# Altium schematic sheet Current Measurement.SchDoc
size C; DrawnBy: Ross Harvey; Engineer: Ross Harvey; Revision: A; SheetNumber: 2; SheetTotal: 7
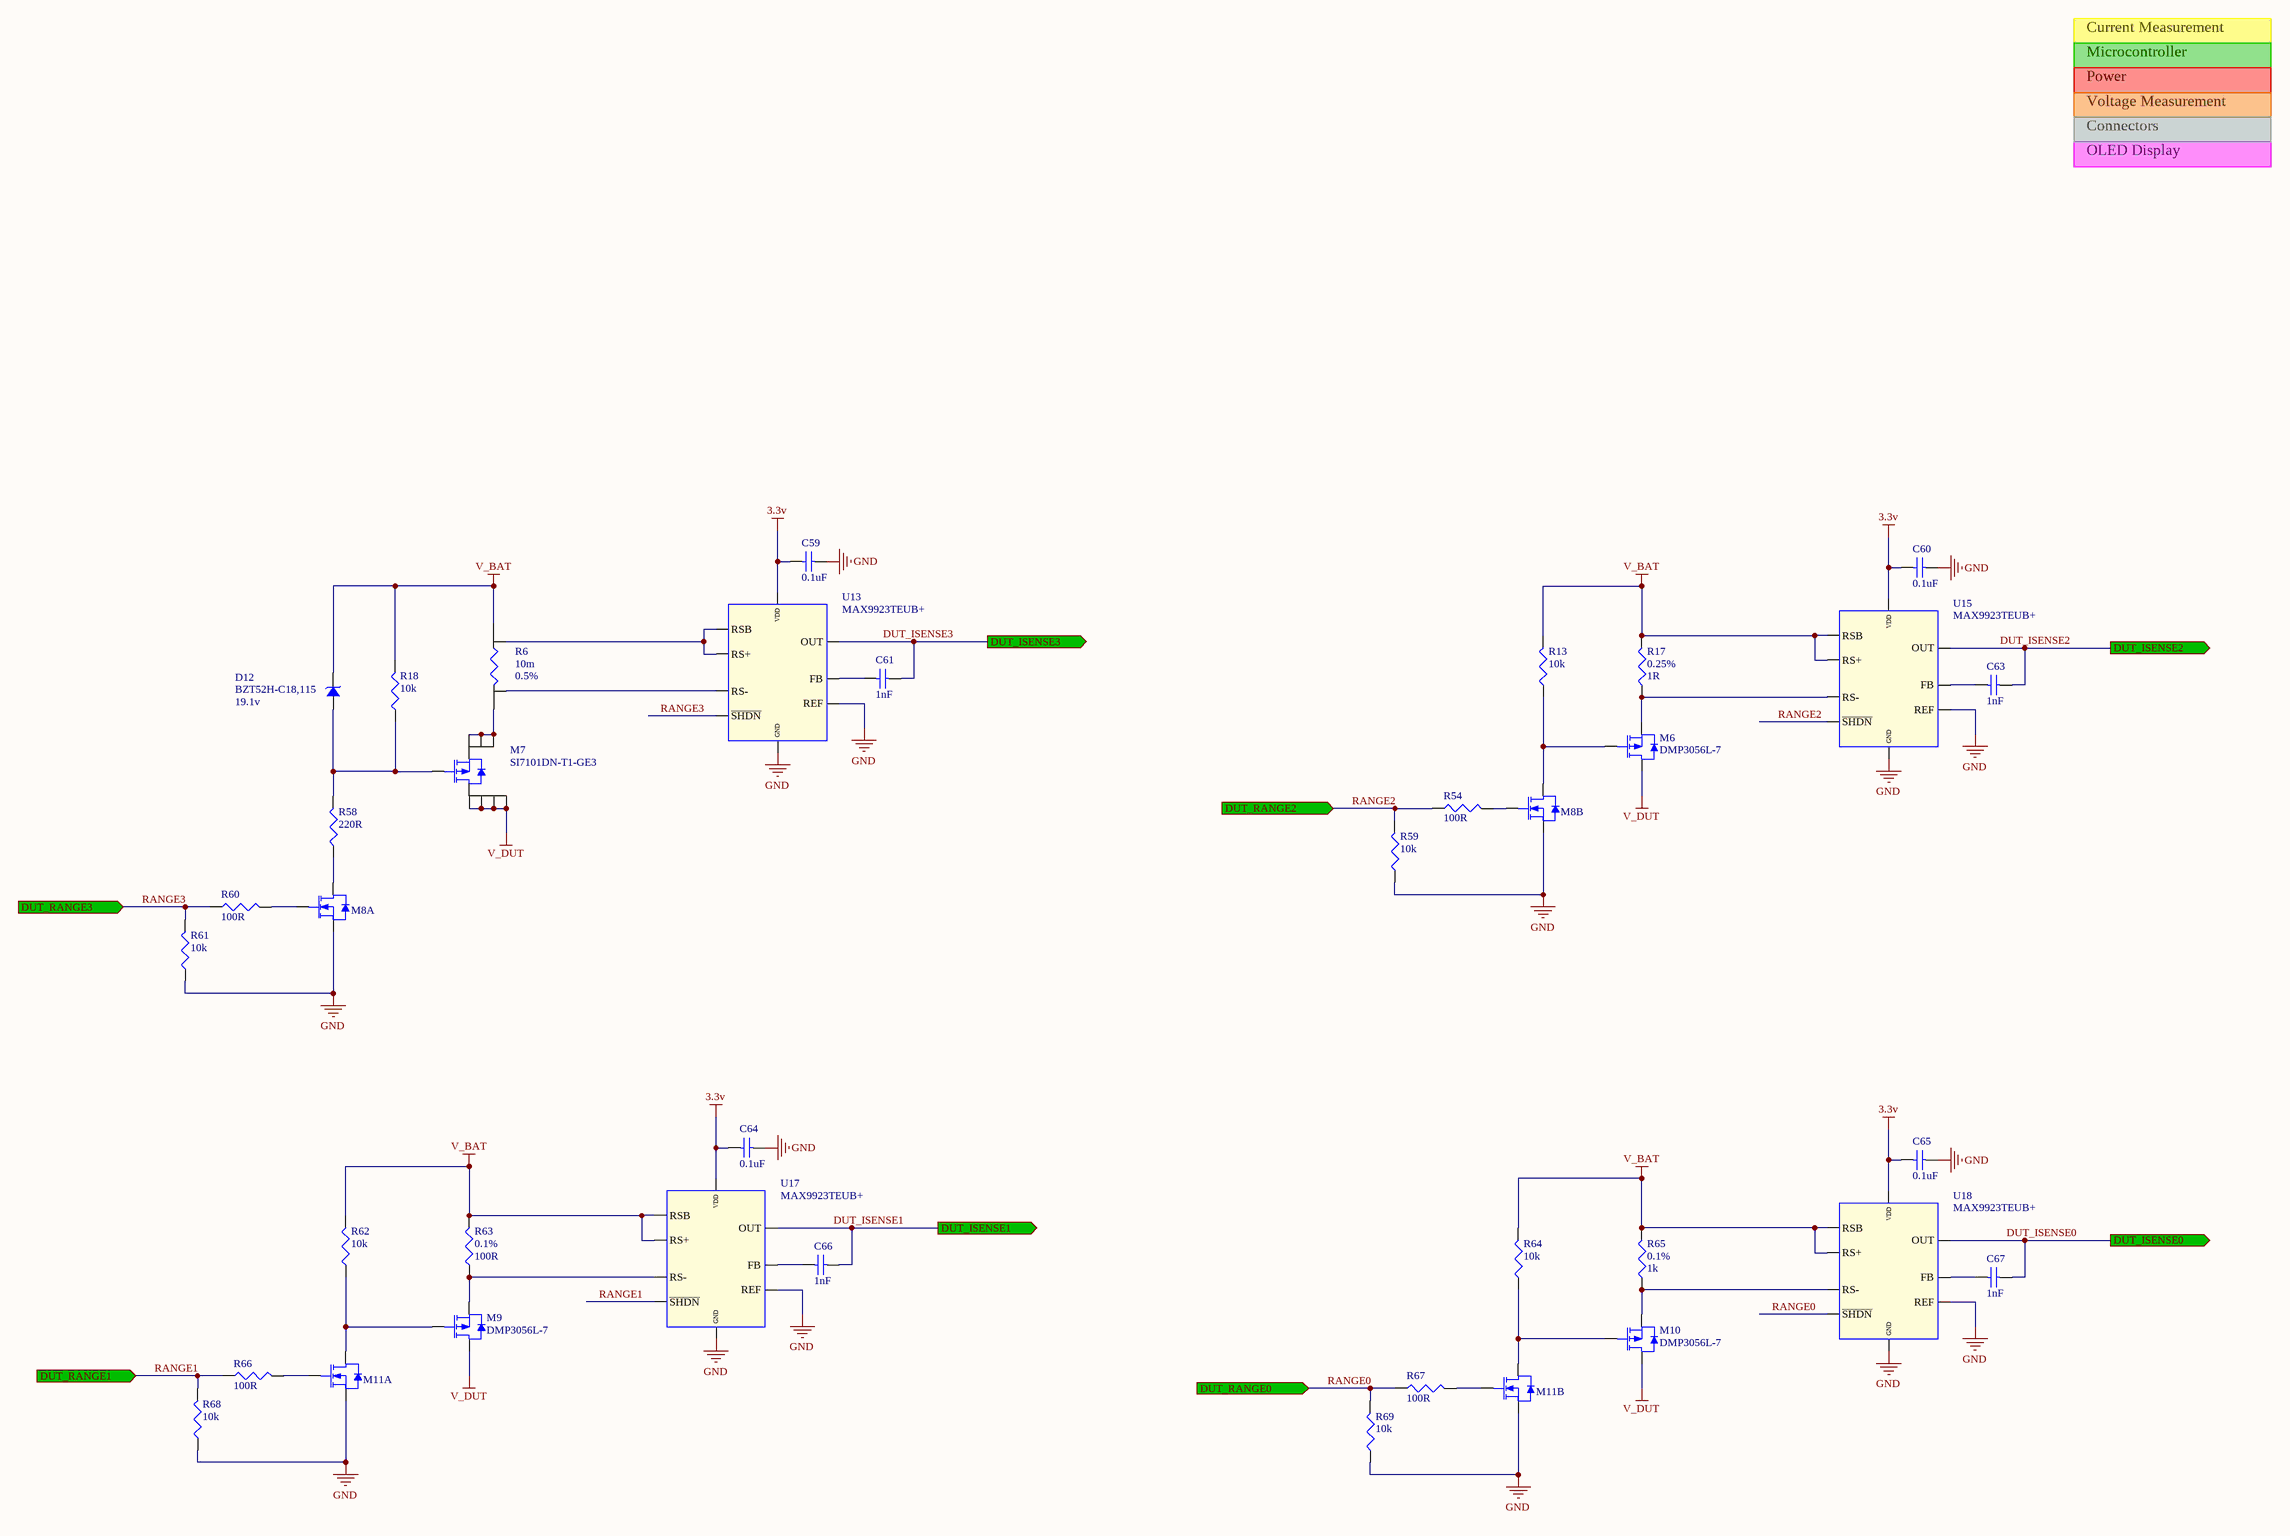
[diagram p0: Current Measurement.SchDoc]

## Parts
C59  0.1uF  [CAP0402R]
C60  0.1uF  [CAP0402R]
C61  1nF  [CAP0402R]
C63  1nF  [CAP0402R]
C64  0.1uF  [CAP0402R]
C65  0.1uF  [CAP0402R]
C66  1nF  [CAP0402R]
C67  1nF  [CAP0402R]
D12  BZT52H-C18,115  OPER_VOLTAGE: 19.1v  [SOD-123]
M6  DMP3056L-7  [SOT23-3M]
M7  SI7101DN-T1-GE3  [PowerPAK-1212-8]
M8  NX3020NAKV,115  [SOT666-6N]  (value not drawn)  (parts A,B of 2)
M9  DMP3056L-7  [SOT23-3M]
M10  DMP3056L-7  [SOT23-3M]
M11  NX3020NAKV,115  [SOT666-6N]  (value not drawn)  (parts A,B of 2)
R6  10m  TOLERANCE: 0.5%  [2512 4 Terminal]
R13  10k  [RES0603R]
R17  Tolerance: 0.25%  [RES0805R]  (hidden comment: 1R)
R18  10k  [RES0603R]
R54  100R  [RES0402R]
R58  220R  [RES0603R]
R59  10k  [RES0402R]
R60  100R  [RES0402R]
R61  10k  [RES0402R]
R62  10k  [RES0603R]
R63  Tolerance: 0.1%  [RES0603W]  (hidden comment: 100R)
R64  10k  [RES0603R]
R65  Tolerance: 0.1%  [RES0603W]  (hidden comment: 1k)
R66  100R  [RES0402R]
R67  100R  [RES0402R]
R68  10k  [RES0402R]
R69  10k  [RES0402R]
U13  MAX9923TEUB+  [uMAX10]
U15  MAX9923TEUB+  [uMAX10]
U17  MAX9923TEUB+  [uMAX10]
U18  MAX9923TEUB+  [uMAX10]

## Ports
DUT_ISENSE0 (out), DUT_ISENSE1 (out), DUT_ISENSE2 (out), DUT_ISENSE3 (out), DUT_RANGE0 (in), DUT_RANGE1 (in), DUT_RANGE2 (in), DUT_RANGE3 (in)

## Nets
3.3v: C59.1 C60.1 C64.1 C65.1 U13.10(VDD) U15.10(VDD) U17.10(VDD) U18.10(VDD)
GND: C59.2 C60.2 C64.2 C65.2 M8.1(S1) M8.4(S2) M11.1(S1) M11.4(S2) R59.1 R61.1 R68.1 R69.1 U13.5(GND) U13.7(REF) U15.5(GND) U15.7(REF) U17.5(GND) U17.7(REF) U18.5(GND) U18.7(REF)
V_BAT: D12.1(K) R6.3 R13.2 R17.2 R18.2 R62.2 R63.2 R64.2 R65.2 U15.1(RSB) U15.2(RS+) U17.1(RSB) U17.2(RS+) U18.1(RSB) U18.2(RS+)
V_DUT: M6.3(SOURCE) M7.5 M7.6 M7.7 M7.8 M9.3(SOURCE) M10.3(SOURCE)
DUT_ISENSE0: C67.2 U18.9(OUT) ; port DUT_ISENSE0
DUT_ISENSE1: C66.2 U17.9(OUT) ; port DUT_ISENSE1
DUT_ISENSE2: C63.2 U15.9(OUT) ; port DUT_ISENSE2
DUT_ISENSE3: C61.2 U13.9(OUT) ; port DUT_ISENSE3
RANGE0: R67.1 R69.2 U18.6(~{SHDN}) ; port DUT_RANGE0
RANGE1: R66.1 R68.2 U17.6(~{SHDN}) ; port DUT_RANGE1
RANGE2: R54.1 R59.2 U15.6(~{SHDN}) ; port DUT_RANGE2
RANGE3: R60.1 R61.2 U13.6(~{SHDN}) ; port DUT_RANGE3
NetC61_1: C61.1 U13.8(FB)
NetC63_1: C63.1 U15.8(FB)
NetC66_1: C66.1 U17.8(FB)
NetC67_1: C67.1 U18.8(FB)
NetD12_2: D12.2(A) M7.4 R18.1 R58.2
NetM6_1: M6.1(GATE) M8.3(D2) R13.1
NetM6_2: M6.2(DRAIN) R17.1 U15.3(RS-)
NetM7_1: M7.1 M7.2 M7.3 R6.1
NetM8_2: M8.2(G1) R60.2
NetM8_5: M8.5(G2) R54.2
NetM8_6: M8.6(D1) R58.1
NetM9_1: M9.1(GATE) M11.6(D1) R62.1
NetM9_2: M9.2(DRAIN) R63.1 U17.3(RS-)
NetM10_1: M10.1(GATE) M11.3(D2) R64.1
NetM10_2: M10.2(DRAIN) R65.1 U18.3(RS-)
NetM11_2: M11.2(G1) R66.2
NetM11_5: M11.5(G2) R67.2
NetR6_2: R6.2 U13.3(RS-)
NetR6_4: R6.4 U13.1(RSB) U13.2(RS+)

Not connected (* = marked no-connect by the designer): U13 4(NC); U15 4(NC); U17 4(NC); U18 4(NC)

## Notes on the sheet
- Current Measurement
- Microcontroller
- Power
- Voltage Measurement
- Connectors
- OLED Display

## Library data of the parts
C59 C60 C64 C65 = 0.1uF (0402): Tolerance: 20%; MFG_PN: VJ0402G104MXQCW1BC; MFG: Vishay; Voltage: 10v; LOAD: NL; Value: 0.1uF
C61 C63 C66 C67 = 1nF (0402): Tolerance: 10%; MFG_PN: VJ0402Y102KXAAC; MFG: Vishay; Voltage: 50v; LOAD: NL; Value: 1nF
D12 = BZT52H-C18: 19.1v Zener Diode; MFG: NXP; LOAD: NL; CURRENT: 250mA; MFG_PN: BZT52H-C18,115
M6 M9 M10 = DMP3056L: PFET_SINGLE_4.3A_30v; LOAD: NL; MFG: DIODES_INC; VDS_MAX: -30v; I_MAX: -4.3A; VGS_MAX: 25v; P_MAX: 1.38W; RDS_ON: 35m; VGS_TH: -1v; MFG_PN: DMP3056L-7
M7 = SI7101DN: PFET_SINGLE_35A_30v; MFG: VISHAY; LOAD: NL; CURRENT: 35A; VGS_MAX: 20V; VDS_MAX: 30V; RDS: 7.2m; POWER: 52W; MFG_PN: SI7101DN-T1-GE3
M8 M11 = NX3020NAKV: NFET_DUAL_200mA_30v; LOAD: NL; MFG: NXP; VDS_MAX: 30v; I_MAX: 200mA; P_MAX: 1.1W; RDS_ON: 2.7; VGS_MAX: *; MFG_PN: NX3020NAKV,115
R6 = 10m 0.5% (2512 4-Terminal): 10mR Current Sense - 4-Terminal; MFG_PN: WSK2512R0100DEA; MFG: VISHAY; POWER: 1W; LOAD: NL; VALUE: 10m
R13 R18 R62 R64 = 10K (0603): Tolerance: 1%; POWER: 0.1W; MFG_PN: CRCW060310K0FKEA; MFG: Vishay; Load: NL; Value: 10k
R17 = 1R 0.25% (0805): POWER: 100mW; MFG_PN: CRT0805-CY-1R00ELF; MFG: Bourns; Load: NL; Value: 1R
R54 R60 R66 R67 = 100R (0402): Tolerance: 1%; POWER: 63mW; MFG_PN: CRCW0402100RFKED; MFG: Vishay; Load: NL; Value: 100R
R58 = 220R (0603): Tolerance: 1%; POWER: 0.1W; MFG_PN: CRCW0603220RFKEB; MFG: Vishay; Load: NL; Value: 220R
R59 R61 R68 R69 = 10k (0402): Tolerance: 1%; POWER: 63mW; MFG_PN: CRCW040210K0FKED; MFG: Vishay; Load: NL; Value: 10k
R63 = 100R   0.1% (0603): POWER: 0.1W; MFG_PN: TNPW0603100RBEEA; MFG: Vishay; Load: NL; TEMP_COEF: 20ppm; Value: 100R
R65 = 1k   0.1% (0603): POWER: 0.1W; MFG_PN: TNPW06031K00BEEA; MFG: Vishay; Load: NL; TEMP_COEF: 25ppm; Value: 1k
U13 U15 U17 U18 = MAX9923TEUB+: Ultra-Precision High Side Current Shunt Amp; LOAD: NL; MFG: MAXIM; GBW: 50kHz; Vos: 25uV; Ib: 1pA; GAIN: 25V/V; MFG_PN: MAX9923TEUB+